# EAGLE design USB-Knob (EAGLE 7.2.0)
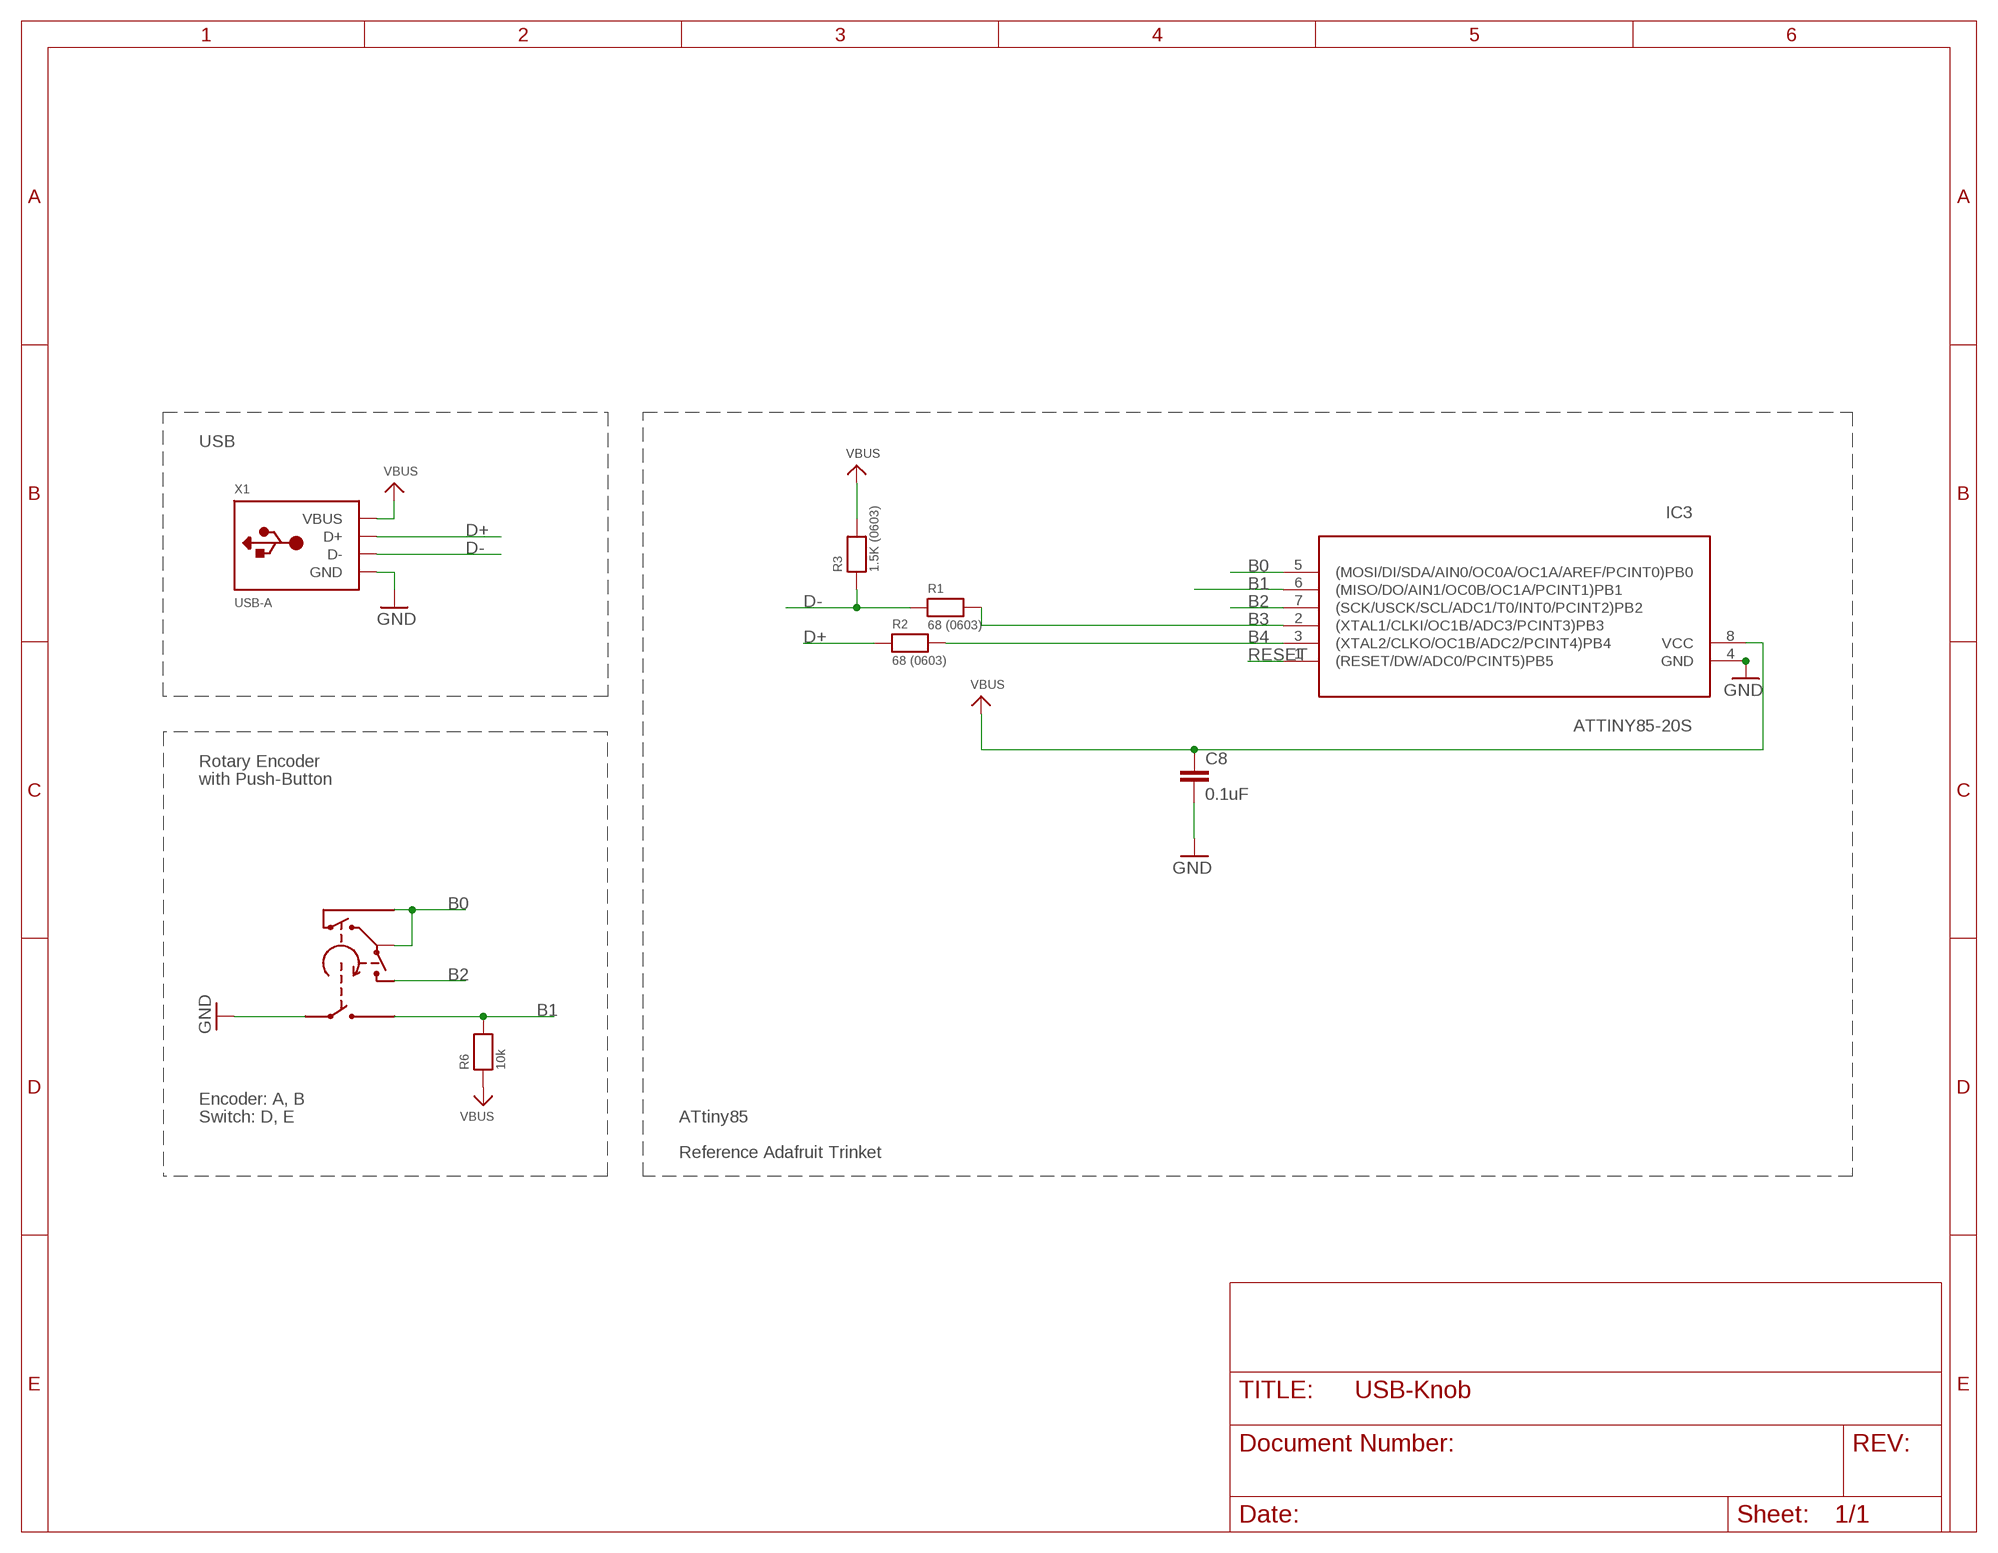
[diagram p0: schematic, sheet 1]

## Parts
C8  0.1uF  CAP0603-CAP  [0603-CAP]
IC3  ATTINY85-20S  ATTINY85V-10S  [SOIC8]
R1  68 (0603)  RESISTOR_0603_NOOUT  [0603-NO]
R2  68 (0603)  RESISTOR_0603_NOOUT  [0603-NO]
R3  1.5K (0603)  RESISTOR_0603_NOOUT  [0603-NO]
R6  10k  RESISTOR_0603_NOOUT  [0603-NO]
U$1  EVE-S  [EVE-S]
X1  USB-A  [MOLEX_480371000]

## Nets
B0: IC3.5((MOSI/DI/SDA/AIN0/OC0A/OC1A/AREF/PCINT0)PB0) U$1.1(A) U$1.GND0(COM) U$1.GND1(COM) U$1.GND2(COM)
B1: IC3.6((MISO/DO/AIN1/OC0B/OC1A/PCINT1)PB1) R6.2 U$1.B2(S2)
B2: IC3.7((SCK/USCK/SCL/ADC1/T0/INT0/PCINT2)PB2) U$1.2(B)
B3: IC3.2((XTAL1/CLKI/OC1B/ADC3/PCINT3)PB3) R1.2
B4: IC3.3((XTAL2/CLKO/OC1B/ADC2/PCINT4)PB4) R2.2
D+: R2.1 X1.3(D+)
D-: R1.1 R3.1 X1.2(D-)
GND: C8.2 IC3.4(GND) U$1.B1(S1) X1.4(GND)
RESET: IC3.1((RESET/DW/ADC0/PCINT5)PB5)
VBUS: C8.1 IC3.8(VCC) R3.2 R6.1 X1.1(VBUS)

## Notes on the sheet
- USB
- Rotary Encoder
- with Push-Button
- Encoder: A, B
- Switch: D, E | ATtiny85
- Reference Adafruit Trinket

## Library data of the parts
C8 = SparkFun-Capacitors:CAP: Capacitor Standard 0603 ceramic capacitor, and 0.1" leaded capacitor.
IC3 = avr:ATTINY85: MICROCONTROLLER 8 Kbytes FLASH 512 bytes EEPROM 512 bytes RAM 4-channel 10 bit ADC USI
R1-R3 R6 = microbuilder:RESISTOR: Resistors For new designs, use the packages preceded by an '_' character since they are more reliable: The following footprints should be used on most boards: _0402 - Standard footprint for regular board layouts _0603 - Standard footprint for regular board layouts _0805 - Standard footprint for regular board layouts For extremely tight-pitch boards where space is at a premium, the following 'micro-pitch' footprints can be used (smaller pads, no silkscreen outline, etc.): _0402MP - Micro-pitch footprint for very dense/compact boards _0603MP - Micro-pitch footprint for very dense/compact boards _0805MP - Micro-pitch footprint for very dense/compact boards
U$1 = digikey:EVE-S
X1 = adafruit:USB-A: USB type A 'plug' Used for things that can directly connect to a USB port, say USB key

## Net classes
1 power: width 0.305 mm

## Board
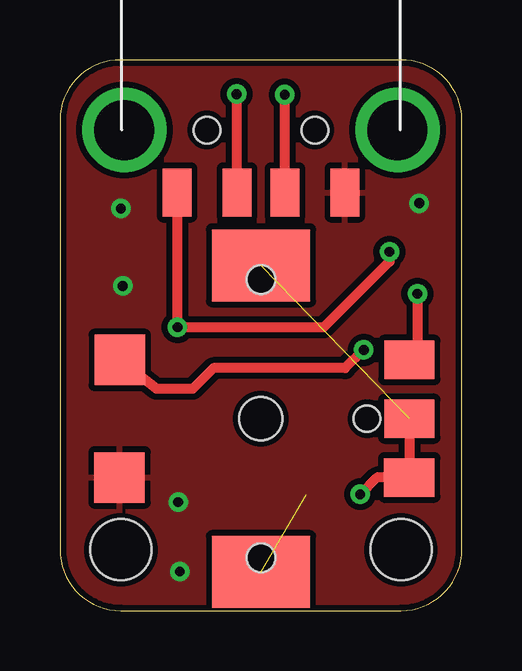
[diagram p1: board, top side]
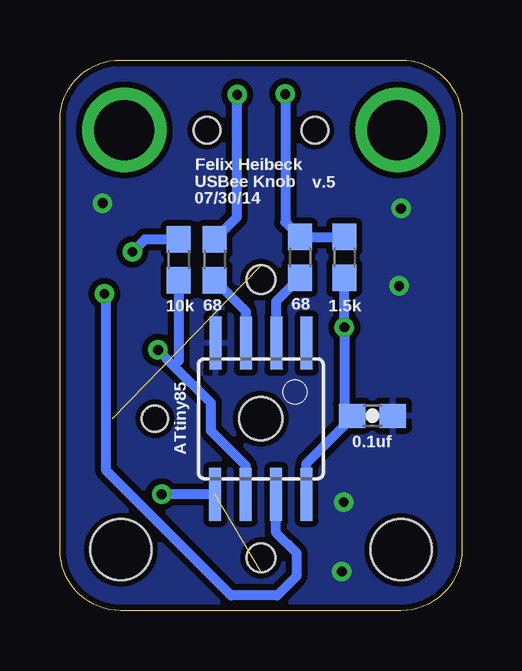
[diagram p2: board, bottom side, seen from below]

Size 16.76 x 22.96 mm. Coordinates in mm from the lower left corner, seen from the top.
Outline: 0,20.47 0,2.54 arc90 2.54,0 14.22,0 arc90 16.76,2.54 16.76,20.47 arc90 14.22,22.96 2.54,22.96 arc90 0,20.47
Copper layers (1*16): Top 0.035mm / dielectric 1.5mm / Bottom 0.035mm
Design rules "adafruit *": minimum track width 8mil, minimum drill 15.5mil, track to track 10mil, track to pad 10mil, pad to pad 10mil, via to via 10mil, smd to smd 8mil, copper to edge 10mil, drill to drill 8mil, minimum pad ring 10mil, minimum via ring 8mil, stop-mask expansion 4mil, vias tented up to drill 20mil, thermal gap 10mil
Holes 2.54 mm at 2.54,2.54 14.22,2.54

### Footprints (pad centres in the part's own frame; a part is rotated, then mirrored left to right if it is on the bottom)
0603-CAP = smd 1.1 x 1: 1 -0.85,0; 2 0.85,0
SOIC8 = smd 0.5 x 2.2: 1 -1.905,-3.154; 2 -0.645,-3.154; 3 0.625,-3.154; 4 1.895,-3.154; 5 1.905,3.154; 6 0.635,3.154; 7 -0.635,3.154; 8 -1.905,3.154
0603-NO = smd 1.1 x 1: 1 -0.85,0; 2 0.85,0
EVE-S = smd 1.6 x 2.1: 1 -2.451,-6.185; 2 2.454,-6.19; GND0 0.003,-6.193 | smd 2.1 x 2.1: B1 -2.454,5.9; B2 2.456,5.89 | smd 3 x 4.1: GND1 -6.386,-0.003; GND2 6.396,-0.003 | hole 1.8: 0.003,0 | hole 1.2: -5.794,-0.003; 5.799,0 | hole 1.1: 0,-4.422
MOLEX_480371000 = smd 1.2 x 2: 1 3.5,2.6; 2 1,2.6; 3 -1,2.6; 4 -3.5,2.6 | drill 2.5: M1 -5.7,0; M2 5.7,0 | hole 1.1: -2.25,0; 2.25,0

### Placement (x,y rotation side)
C8  3.73,8.13 0 bottom
IC3  8.38,8 180 bottom
R1  6.76,14.73 270 bottom
R2  10.31,14.63 270 bottom
R3  4.9,14.73 270 bottom
R6  11.81,14.63 270 bottom
U$1  8.38,8 90 top
X1  8.38,20.04 180 top

### Tracks (layer width: path | path; a pad name or v marks a point on that pad's centre or on a via)
B0  (via drill 0.41)  (2 unrouted)
  Top 0.406: v12.52,4.85 13.22,5.55 U$1.1 U$1.GND0
  Bottom 0.406: IC3.5 v12.52,4.85
B1  (via drill 0.41)
  Top 0.406: v12.68,10.87 12.65,10.87 11.89,10.11 6.4,10.11 5.54,9.25 4.03,9.25 U$1.B2
  Bottom 0.406: IC3.6 9.02,6.04 10.46,7.49 10.46,8.66 12.01,10.21 | 12.01,10.21 v12.68,10.87 | R6.2 11.81,10.41 12.01,10.21
B2  (via drill 0.41)
  Top 0.406: v14.91,13.21 14.91,10.47 U$1.2
  Bottom 0.406: IC3.7 7.75,3.25 6.91,2.41 6.91,1.42 7.7,0.63 9.63,0.63 14.83,5.84 14.83,13.13 v14.91,13.21 14.81,13.11
B3
  Bottom 0.406: IC3.2 7.74,12.9 R1.2
B4
  Bottom 0.406: IC3.3 9.01,12.47 R2.2
D+  (via drill 0.41)
  Top 0.406: 9.4,17.46 X1.3 arc-45 9.37,17.46 v9.37,21.51
  Bottom 0.406: v9.37,21.51 arc-45 9.4,21.45 9.4,16.4 R2.1
D-  (via drill 0.41)
  Top 0.406: v7.37,21.54 7.37,17.46 X1.2
  Bottom 0.406: R3.1 R1.1 7.37,16.19 v7.37,21.54
GND  (via drill 0.41)
  other vias: 2.62,13.54 14.99,16.99 5,1.63 4.93,4.52 2.54,16.76
  pour Bottom: -2.41,23.55 -1.63,-1.27 19.91,-1.6 20.4,23.49
  pour Top: -1.6,26.24 -1.57,-1.37 17.96,-2.03 18.62,25.88
VBUS  (via drill 0.41)
  Top 0.406: X1.1 4.88,11.83 v4.9,11.81 11,11.81 13.74,14.55 v13.74,14.96
  Bottom 0.406: R3.2 v4.9,11.81 4.9,7.81 | 4.9,7.81 4.9,7.72 6.48,6.15 IC3.8 | 4.9,7.81 C8.1 | R6.1 13.22,15.48 v13.74,14.96

### Text on the board
bPlace: v.5 | Felix Heibeck | USBee Knob | 07/30/14 | 1.5k | 68 | 68 | 10k | 0.1uf | ATtiny85